# Altium schematic sheet PULSE.SchDoc: PULSE
size 420 x 297 mm; Date: March 14; CheckedBy: ThS. Bùi Quốc Bảo; DrawnBy: Nguyễn Gia Huy; Revision: V1.0; SheetNumber: 7; SheetTotal: 11; MasterProject: STM32-PLC; Sub-system: DA1_prj.PrjPcb
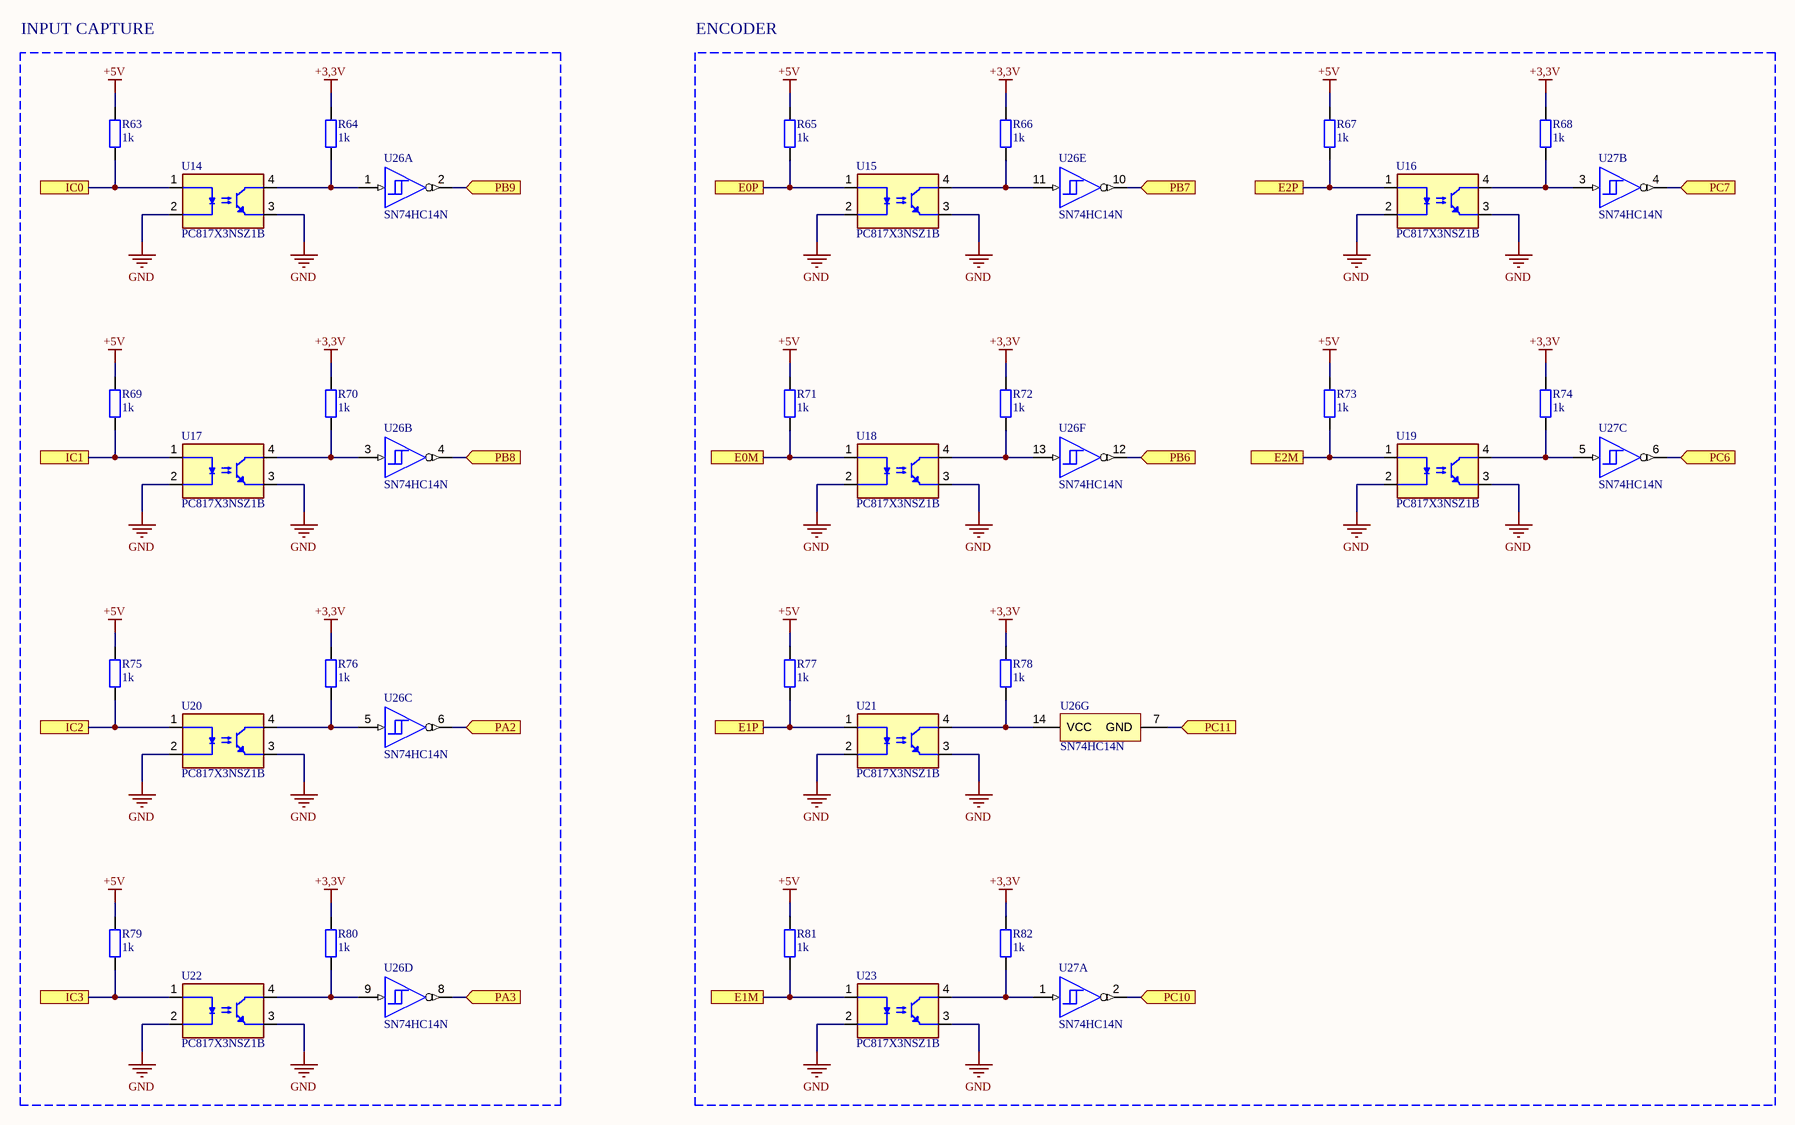
[diagram p0: PULSE.SchDoc]

## Parts
R63  1k  [tro smd 0603]
R64  1k  [tro smd 0603]
R65  1k  [tro smd 0603]
R66  1k  [tro smd 0603]
R67  1k  [tro smd 0603]
R68  1k  [tro smd 0603]
R69  1k  [tro smd 0603]
R70  1k  [tro smd 0603]
R71  1k  [tro smd 0603]
R72  1k  [tro smd 0603]
R73  1k  [tro smd 0603]
R74  1k  [tro smd 0603]
R75  1k  [tro smd 0603]
R76  1k  [tro smd 0603]
R77  1k  [tro smd 0603]
R78  1k  [tro smd 0603]
R79  1k  [tro smd 0603]
R80  1k  [tro smd 0603]
R81  1k  [tro smd 0603]
R82  1k  [tro smd 0603]
U14  PC817X3NSZ1B  [DIP762W50P254L495H455Q4]
U15  PC817X3NSZ1B  [DIP762W50P254L495H455Q4]
U16  PC817X3NSZ1B  [DIP762W50P254L495H455Q4]
U17  PC817X3NSZ1B  [DIP762W50P254L495H455Q4]
U18  PC817X3NSZ1B  [DIP762W50P254L495H455Q4]
U19  PC817X3NSZ1B  [DIP762W50P254L495H455Q4]
U20  PC817X3NSZ1B  [DIP762W50P254L495H455Q4]
U21  PC817X3NSZ1B  [DIP762W50P254L495H455Q4]
U22  PC817X3NSZ1B  [DIP762W50P254L495H455Q4]
U23  PC817X3NSZ1B  [DIP762W50P254L495H455Q4]
U26  SN74HC14N  [N0014A]  (parts A,B,C,D,E,F,G of 7)
U27  SN74HC14N  [N0014A]  (parts A,B,C of 7)

## Blocks framed on the sheet
INPUT CAPTURE: R63 R64 R69 R70 R75 R76 R79 R80 U14 U17 U20 U22 U26
ENCODER: R65-R68 R71-R74 R77 R78 R81 R82 U15 U16 U18 U19 U21 U23 U26 U27

## Ports
E0M (see STM32_PLC[5B]), E0P (see STM32_PLC[5B]), E1M (see STM32_PLC[5C]), E1P (see STM32_PLC[5B]), E2M (see STM32_PLC[5C]), E2P (see STM32_PLC[5C]), IC0 (see STM32_PLC[5B]), IC1 (see STM32_PLC[5B]), IC2 (see STM32_PLC[5B]), IC3 (see STM32_PLC[5B]), PA2 (in, see STM32_PLC[1B], STM32_PLC[6B]), PA3 (in, see STM32_PLC[1B], STM32_PLC[6B]), PB6 (in, see STM32_PLC[2B], STM32_PLC[6B]), PB7 (in, see STM32_PLC[2B], STM32_PLC[6B]), PB8 (in, see STM32_PLC[2B], STM32_PLC[6B]), PB9 (in, see STM32_PLC[2B], STM32_PLC[6B]), PC6 (in, see STM32_PLC[2B], STM32_PLC[6C]), PC7 (in, see STM32_PLC[3B], STM32_PLC[6C]), PC10 (in, see STM32_PLC[3B], STM32_PLC[6C]), PC11 (in, see STM32_PLC[3B], STM32_PLC[6B])

## Nets
+3,3V: R64.2 R66.2 R68.2 R70.2 R72.2 R74.2 R76.2 R78.2 R80.2 R82.2
+5V: R63.2 R65.2 R67.2 R69.2 R71.2 R73.2 R75.2 R77.2 R79.2 R81.2
GND: U14.2(CATHODE) U14.3(EMITTER) U15.2(CATHODE) U15.3(EMITTER) U16.2(CATHODE) U16.3(EMITTER) U17.2(CATHODE) U17.3(EMITTER) U18.2(CATHODE) U18.3(EMITTER) U19.2(CATHODE) U19.3(EMITTER) U20.2(CATHODE) U20.3(EMITTER) U21.2(CATHODE) U21.3(EMITTER) U22.2(CATHODE) U22.3(EMITTER) U23.2(CATHODE) U23.3(EMITTER)
E0M: R71.1 U18.1(ANODE) ; port E0M
E0P: R65.1 U15.1(ANODE) ; port E0P
E1M: R81.1 U23.1(ANODE) ; port E1M
E1P: R77.1 U21.1(ANODE) ; port E1P
E2M: R73.1 U19.1(ANODE) ; port E2M
E2P: R67.1 U16.1(ANODE) ; port E2P
IC0: R63.1 U14.1(ANODE) ; port IC0
IC1: R69.1 U17.1(ANODE) ; port IC1
IC2: R75.1 U20.1(ANODE) ; port IC2
IC3: R79.1 U22.1(ANODE) ; port IC3
PA2: U26.6(~{3Y}) ; port PA2
PA3: U26.8(~{4Y}) ; port PA3
PB6: U26.12(~{6Y}) ; port PB6
PB7: U26.10(~{5Y}) ; port PB7
PB8: U26.4(~{2Y}) ; port PB8
PB9: U26.2(~{1Y}) ; port PB9
PC6: U27.6(~{3Y}) ; port PC6
PC7: U27.4(~{2Y}) ; port PC7
PC10: U27.2(~{1Y}) ; port PC10
PC11: U26.7(GND) ; port PC11
NetR64_1: R64.1 U14.4(COLLECTOR) U26.1(1A)
NetR66_1: R66.1 U15.4(COLLECTOR) U26.11(5A)
NetR68_1: R68.1 U16.4(COLLECTOR) U27.3(2A)
NetR70_1: R70.1 U17.4(COLLECTOR) U26.3(2A)
NetR72_1: R72.1 U18.4(COLLECTOR) U26.13(6A)
NetR74_1: R74.1 U19.4(COLLECTOR) U27.5(3A)
NetR76_1: R76.1 U20.4(COLLECTOR) U26.5(3A)
NetR78_1: R78.1 U21.4(COLLECTOR) U26.14(VCC)
NetR80_1: R80.1 U22.4(COLLECTOR) U26.9(4A)
NetR82_1: R82.1 U23.4(COLLECTOR) U27.1(1A)

## Notes on the sheet
- Sub-system:
- Project:
- Design by:
- Sheet title:
- Sheet
- of
- Checked by:
- Approved by:
- Doc No:
- Revision:
- Size:
- Dates:
- A3

## Library data of the parts
R63-R82 = Tro 0603 1% 10k: RES; Chung_Loai: Dán; Don_Vi: Con; So_Chan: 2; Ten_Linh_Kien: Trở 0603 1% 10k; Ma_Hang: MH006333; Kieu_Chan: *
U14-U23 = PC817X3NSZ1B: Optoisolator Transistor Output - 1 Channel 4-DIP; MF: Sharp Microelectronics; SnapEDA_Link: https://www.snapeda.com/parts/PC817X3NSZ1B/Sharp+Microelectronics/view-part/?ref=snap; Price: None; Purchase-URL: https://pricing.snapeda.com/search/part/PC817X3NSZ1B/?ref=eda; Check_prices: https://www.snapeda.com/parts/PC817X3NSZ1B/Sharp+Microelectronics/view-part/?ref=eda; MP: PC817X3NSZ1B; Value: *; Availability: In Stock; Package: DIP-4 Sharp Microelectronics
U26 U27 = CMP-1615-00889-3: Hex Schmitt-Trigger Inverters, N0014A, TUBE; Manufacturer: Texas Instruments; Input Type: CMOS; Voltage(Nom)(V): 5; VCC(Min)(V): 2; tpd @ Nom Voltage(Max)(ns): 31; Technology Family: HC; VCC(Max)(V): 6; F @ Nom Voltage(Max)(Mhz): 20; Output Drive (IOL/IOH)(Max)(mA): -4/4; Rating: Catalog; Schmitt Trigger: Yes; ICC @ Nom Voltage(Max)(mA): 0.02; PackageReference: N0014A; Code_JEDEC: MS-001; Operating Temperature Range(C): -40 to 85; Generic Part Number: SN74HC14; Bits(#): 6; DatasheetVersion: SCLS085G; Output Type: CMOS